# EAGLE schematic WS2812B-strip (EAGLE 6.6.0)
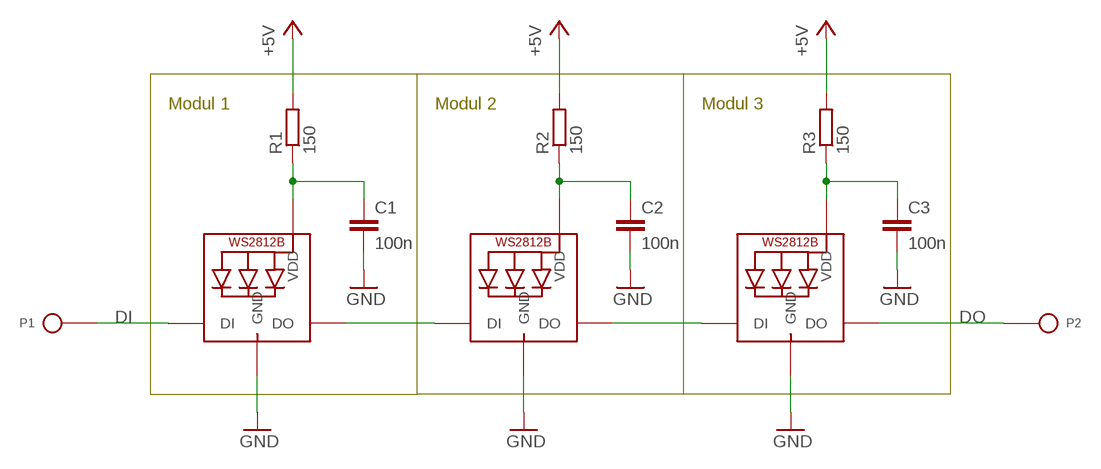
[diagram p0: schematic, sheet 1]

## Parts
C1  100n  C-EUC0805  [C0805]
C2  100n  C-EUC0805  [C0805]
C3  100n  C-EUC0805  [C0805]
LED1  WS2812B3535  [LED3535]
LED2  WS2812B3535  [LED3535]
LED3  WS2812B3535  [LED3535]
P1  RUPAVELIKA  [RUPA2.54]
P2  RUPAVELIKA  [RUPA2.54]
R1  150  R-EU_R0805  [R0805]
R2  150  R-EU_R0805  [R0805]
R3  150  R-EU_R0805  [R0805]

## Nets
+5V: R1.2 R2.2 R3.2
DI: LED1.1(DI) P1.P$1(P)
DIO1: LED1.3(DO) LED2.1(DI)
DIO2: LED2.3(DO) LED3.1(DI)
DO: LED3.3(DO) P2.P$1(P)
GND: C1.2 C2.2 C3.2 LED1.4(GND) LED2.4(GND) LED3.4(GND)
N$1: C1.1 LED1.2(VDD) R1.1
N$2: C2.1 LED2.2(VDD) R2.1
N$3: C3.1 LED3.2(VDD) R3.1

## Notes on the sheet
- Modul 1 | Modul 2 | Modul 3

## Library data of the parts
C1-C3 = rcl:C-EU: CAPACITOR, European symbol
LED1-LED3 = adafruit:WS2812B
P1 P2 = mylib:RUPA
R1-R3 = rcl:R-EU_: RESISTOR, European symbol